# EAGLE design Thermometer1.1 (EAGLE 7.1.0)
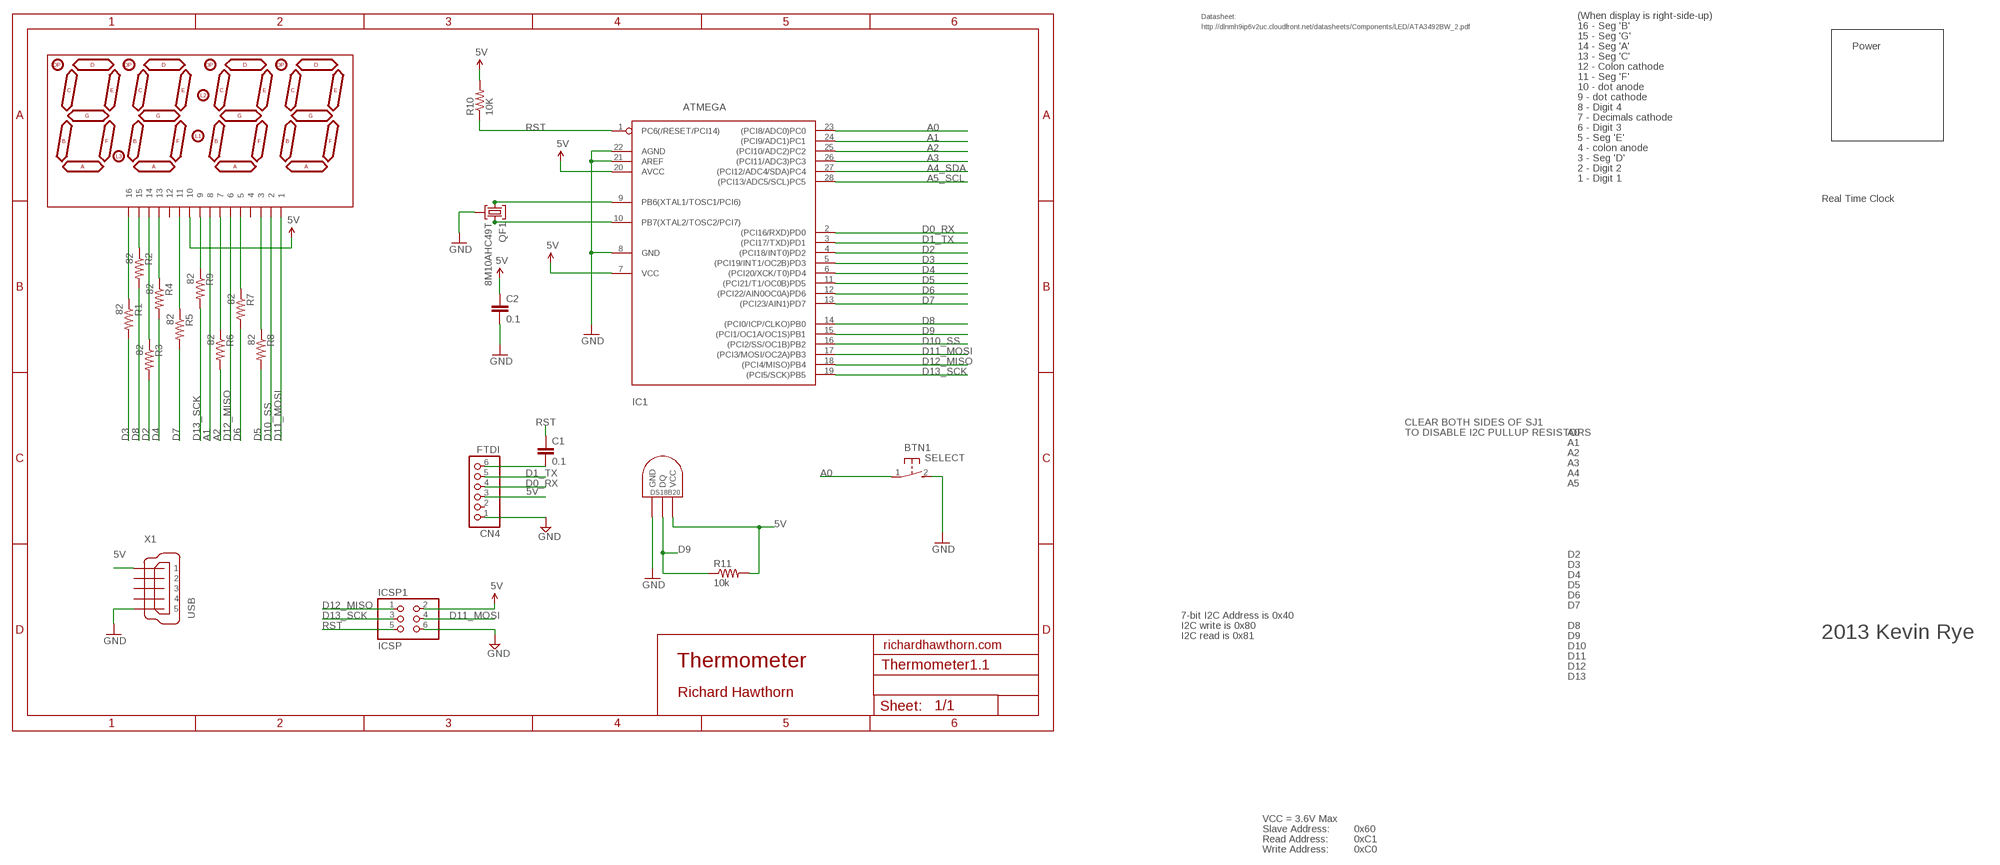
[diagram p0: schematic, sheet 1]

## Parts
BTN1  SELECT  DTS-3  [DTS-3]
C1  0.1  CAPPTH2  [CAP-PTH-SMALL2]
C2  0.1  CAPPTH2  [CAP-PTH-SMALL2]
CN4  FTDI  PINHD-1X6  [1X06]
IC1  ATMEGA  ATMEGA168PROUND  [DIL28-3-ROUND]
ICSP1  ICSP  PINHD-2X3  [2X03]
LED1  7SEG-4DIGIT  [SPARKFUN_7-SEGMENT-4DIGIT]
QF1  8M10AHC49T  [HC49U]
R1  82  R-US_0204/7  [0204/7]
R2  82  R-US_0204/7  [0204/7]
R3  82  R-US_0204/7  [0204/7]
R4  82  R-US_0204/7  [0204/7]
R5  82  R-US_0204/7  [0204/7]
R6  82  R-US_0204/7  [0204/7]
R7  82  R-US_0204/7  [0204/7]
R8  82  R-US_0204/7  [0204/7]
R9  82  R-US_0204/7  [0204/7]
R10  10K  R-US_0204/7  [0204/7]
R11  10k  R-US_0204/7  [0204/7]
U$1  DS1820TO92  [DS1820]
X1  USB  MINI-USB_SHIELD5P2-32005-601  [32005-601]

## Nets
5V: C2.1 CN4.3 IC1.7(VCC) IC1.20(AVCC) ICSP1.2 LED1.10 R10.2 R11.2 U$1.VDD(VCC) X1.1
A0: BTN1.1 IC1.23((PCI8/ADC0)PC0)
A1: IC1.24((PCI9/ADC1)PC1) R9.2
A2: IC1.25((PCI10/ADC2)PC2) R6.2
A3: IC1.26((PCI11/ADC3)PC3)
A4_SDA: IC1.27((PCI12/ADC4/SDA)PC4)
A5_SCL: IC1.28((PCI13/ADC5/SCL)PC5)
D0_RX: CN4.4 IC1.2((PCI16/RXD)PD0)
D1_TX: CN4.5 IC1.3((PCI17/TXD)PD1)
D2: IC1.4((PCI18/INT0)PD2) R3.2
D3: IC1.5((PCI19/INT1/OC2B)PD3) R1.2
D4: IC1.6((PCI20/XCK/T0)PD4) R4.2
D5: IC1.11((PCI21/T1/OC0B)PD5) R8.2
D6: IC1.12((PCI22/AIN0OC0A)PD6) R7.2
D7: IC1.13((PCI23/AIN1)PD7) R5.2
D8: IC1.14((PCI0/ICP/CLKO)PB0) R2.2
D9: IC1.15((PCI1/OC1A/OC1S)PB1) R11.1 U$1.DQ
D10_SS: IC1.16((PCI2/SS/OC1B)PB2) LED1.1
D11_MOSI: IC1.17((PCI3/MOSI/OC2A)PB3) ICSP1.4 LED1.2
D12_MISO: IC1.18((PCI4/MISO)PB4) ICSP1.1 LED1.6
D13_SCK: IC1.19((PCI5/SCK)PB5) ICSP1.3 LED1.8
GND [power]: BTN1.2 C2.2 CN4.1 IC1.8(GND) IC1.21(AREF) IC1.22(AGND) ICSP1.6 QF1.2 U$1.GND X1.5
N$3: LED1.16 R1.1
N$5: LED1.15 R2.1
N$6: LED1.9 R9.1
N$12: LED1.7 R6.1
N$16: IC1.9(PB6(XTAL1/TOSC1/PCI6)) QF1.1
N$20: C1.2 CN4.6
N$22: LED1.13 R4.1
N$24: LED1.14 R3.1
N$25: LED1.11 R5.1
N$26: IC1.10(PB7(XTAL2/TOSC2/PCI7)) QF1.3
N$29: LED1.5 R7.1
N$30: LED1.3 R8.1
RST: C1.1 IC1.1(PC6(/RESET/PCI14)) ICSP1.5 R10.1
Unconnected: CN4.2 LED1.4 LED1.12 X1.2 X1.3 X1.4 X1.M1(S1) X1.M2(S2)

## Notes on the sheet
- Datasheet: | (When display is right-side-up)
- http://dlnmh9ip6v2uc.cloudfront.net/datasheets/Components/LED/ATA3492BW_2.pdf | 16 - Seg 'B'
- 15 - Seg 'G'
- 14 - Seg 'A' | Power
- 13 - Seg 'C'
- 12 - Colon cathode
- 11 - Seg 'F'
- 10 - dot anode
- 9 - dot cathode
- 8 - Digit 4
- 7 - Decimals cathode
- 6 - Digit 3
- 5 - Seg 'E'
- 4 - colon anode
- 3 - Seg 'D'
- 2 - Digit 2
- 1 - Digit 1
- Real Time Clock
- CLEAR BOTH SIDES OF SJ1
- TO DISABLE I2C PULLUP RESISTORS | A0
- A1
- A2
- A3
- A4
- A5
- D2
- D3
- D4
- D5
- D6
- D7
- 7-bit I2C Address is 0x40
- I2C write is 0x80 | D8
- I2C read is 0x81 | D9 | 2013 Kevin Rye
- richardhawthorn.com | D10
- D11
- Thermometer | D12
- D13
- Richard Hawthorn
- VCC = 3.6V Max
- Slave Address: | 0x60
- Read Address: | 0xC1
- Write Address: | 0xC0

## Library data of the parts
BTN1 = switch-tact:DTS-3
C1 C2 = LowPowerLab:CAP: Capacitor Standard 0603 ceramic capacitor, and 0.1" leaded capacitor.
CN4 = pinhead:PINHD-1X6: PIN HEADER
IC1 = adafruit:ATMEGA168*P: MICROCONTROLLER 16 kBytes FLASH 1 kBytes SRAM 512 Bytes EEPROM USART 8-channel 10 bit ADC
ICSP1 = pinhead:PINHD-2X3: PIN HEADER
LED1 = sparkfun-4digit-sseg:7SEG-4DIGIT
QF1 = crystal:8M10AHC49T: Monolithic Crystal Filters Source: www.vanlong.com; OC_FARNELL: unknown; OC_NEWARK: unknown
R1-R11 = adafruit:R-US_: RESISTOR, American symbol
U$1 = Ava:DS1820: DS18B20 Programmable Resolution 1-Wire Digital Thermometer Description The DS18B20 digital thermometer provides 9-bit to 12-bit Celsius temperature measurements and has an alarm function with nonvolatile user-programmable upper and lower trigger points. The DS18B20 communicates over a 1-Wire® bus that by definition requires only one data line (and ground) for communication with a central microprocessor. It has an operating temperature range of -55°C to +125°C and is accurate to ±0.5°C over the range of -10°C to +85°C. In addition, the DS18B20 can derive power directly from the data line ("parasite power"), eliminating the need for an external power supply. Each DS18B20 has a unique 64-bit serial code, which allows multiple DS18B20s to function on the same 1-Wire bus. Thus, it is simple to use one microprocessor to control many DS18B20s distributed over a large area. Applications that can benefit from this feature include HVAC environmental controls, temperature monitoring systems inside buildings, equipment, or machinery, and process monitoring and control systems.
X1 = con-cypressindustries:MINI-USB_SHIELD5P2-: MINI USB-B R/A DIP 5pol. Source: www.cypressindustries.com; OC_FARNELL: unknown; OC_NEWARK: unknown

## Net classes
1 power: width 0.381 mm, clearance 0.254 mm

## Board
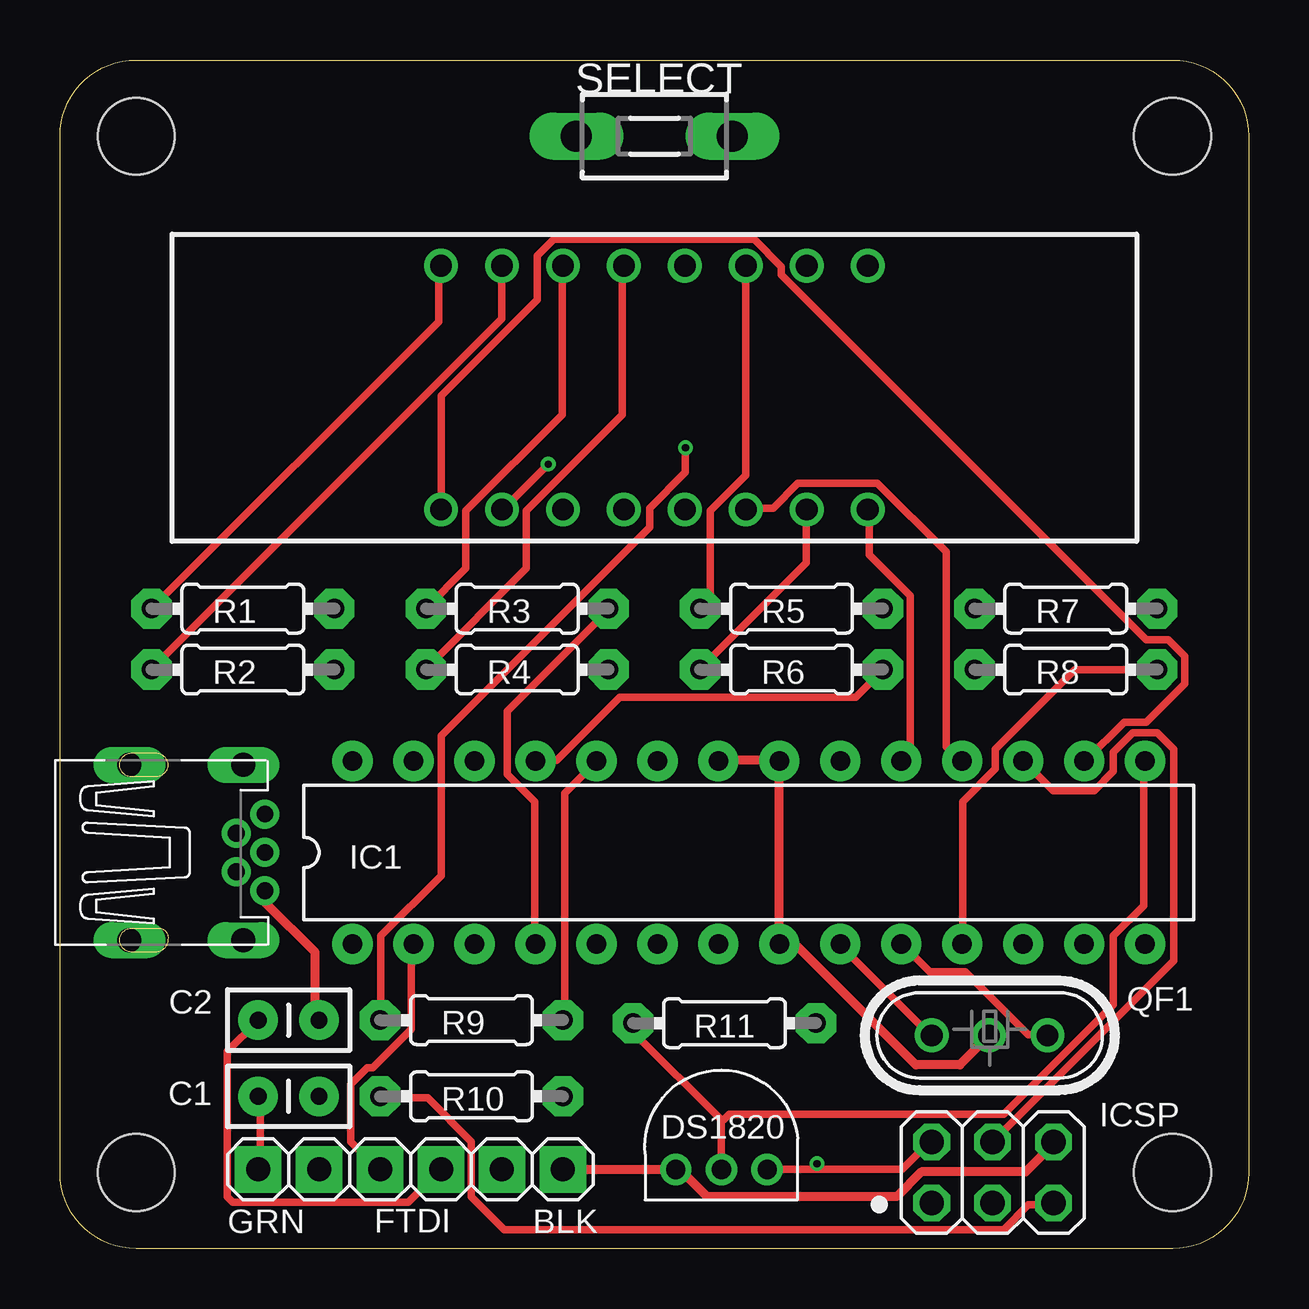
[diagram p1: board, top side]
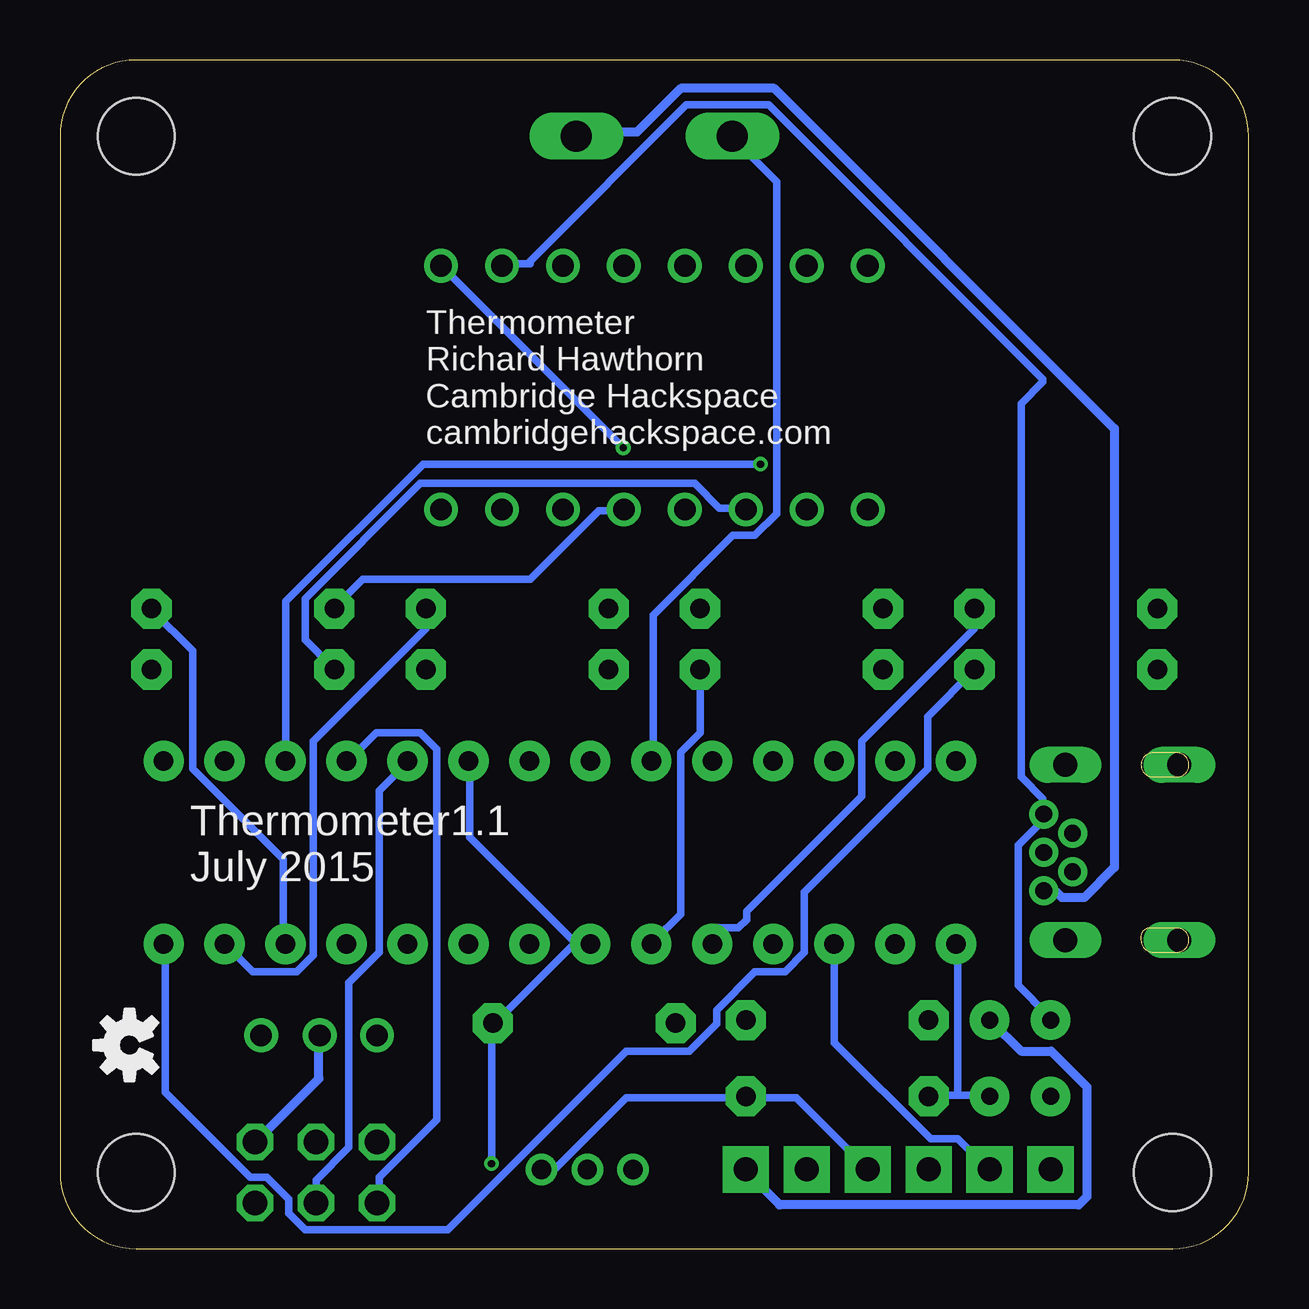
[diagram p2: board, bottom side, seen from below]

Size 49.53 x 49.53 mm. Coordinates in mm from the lower left corner, seen from the top.
Outline: 0,3.17 0,46.35 arc-90 3.17,49.53 46.35,49.53 arc-90 49.53,46.35 49.53,3.17 arc-90 46.35,0 3.17,0 arc-90 0,3.17
Copper layers (1*16): Top 0.035mm / dielectric 1.5mm / Bottom 0.035mm
Design rules "ITEADstudio_DRC *": minimum track width 12mil, minimum drill 12mil, track to track 6mil, track to pad 6mil, pad to pad 6mil, via to via 6mil, smd to smd 0mil, copper to edge 10mil, drill to drill 10mil, minimum pad ring 10mil, minimum via ring 6mil, stop-mask expansion 2mil, vias tented up to drill 100mil, thermal gap 15mil
Holes 3.2 mm at 3.17,3.17 46.35,3.17 3.17,46.35 46.35,46.35
tKeepout: area 0,0 to 5.7,5.7; area 43.8,0 to 49.5,5.7; area 43.8,43.8 to 49.5,49.5; area 0,43.8 to 5.7,49.5
bKeepout: area 0,43.8 to 5.7,49.5; area 43.8,43.8 to 49.5,49.5; area 43.8,0 to 49.5,5.7; area 0,0 to 5.7,5.7
tRestrict: area 24.3,8.9 to 29.1,12.8; area 5.8,16.9 to 6.9,18.5; area 5.2,9.7 to 6.7,10.4
bRestrict: area 27.4,17.7 to 29.2,18.7; area 21.1,13.8 to 22.9,14.9; area 21.6,12.6 to 22.1,13.2; area 20.7,12.6 to 21.2,13.2; area 20.2,12.8 to 20.7,13.5; area 20.1,13.4 to 20.6,14; area 26.5,18.9 to 27.1,19.5; area 26.5,17.9 to 27.1,18.5; area 27.5,19.1 to 28,19.8; area 27.9,18.8 to 29.1,19.6

### Footprints (pad centres in the part's own frame; a part is rotated, then mirrored left to right if it is on the bottom)
DTS-3 = drill 1.3 long: 1 -3.25,0; 2 3.25,0
CAP-PTH-SMALL2 = drill 0.7 pad 1.651: 1 0,0; 2 2.54,0
1X06 = drill 1 pad 1.93 square: 1 -6.35,0; 2 -3.81,0; 3 -1.27,0; 4 1.27,0; 5 3.81,0; 6 6.35,0
DIL28-3-ROUND = drill 0.813 pad 1.676: 1 -16.51,-3.81; 2 -13.97,-3.81; 3 -11.43,-3.81; 4 -8.89,-3.81; 5 -6.35,-3.81; 6 -3.81,-3.81; 7 -1.27,-3.81; 8 1.27,-3.81; 9 3.81,-3.81; 10 6.35,-3.81; 11 8.89,-3.81; 12 11.43,-3.81; 13 13.97,-3.81; 14 16.51,-3.81; 15 16.51,3.81; 16 13.97,3.81; 17 11.43,3.81; 18 8.89,3.81; 19 6.35,3.81; 20 3.81,3.81; 21 1.27,3.81; 22 -1.27,3.81; 23 -3.81,3.81; 24 -6.35,3.81; 25 -8.89,3.81; 26 -11.43,3.81; 27 -13.97,3.81; 28 -16.51,3.81
2X03 = drill 1.016 octagon: 1 -2.54,-1.27; 2 -2.54,1.27; 3 0,-1.27; 4 0,1.27; 5 2.54,-1.27; 6 2.54,1.27
SPARKFUN_7-SEGMENT-4DIGIT = drill 0.9: 1 -8.89,-5.08; 2 -6.35,-5.08; 3 -3.81,-5.08; 4 -1.27,-5.08; 5 1.27,-5.08; 6 3.81,-5.08; 7 6.35,-5.08; 8 8.89,-5.08; 9 8.89,5.08; 10 6.35,5.08; 11 3.81,5.08; 12 1.27,5.08; 13 -1.27,5.08; 14 -3.81,5.08; 15 -6.35,5.08; 16 -8.89,5.08
HC49U = drill 0.9: 1 -2.413,0; 2 -0.027,0; 3 2.413,0
0204/7 = drill 0.813 pad 1.676 octagon: 1 -3.81,0; 2 3.81,0
DS1820 = drill 0.8: DQ 2.54,-1.27; GND 0.635,-1.27; VDD 4.445,-1.27
32005-601 = drill 0.7 pad 1.016: 1 2.825,1.6; 2 1.625,0.8; 3 2.825,0; 4 1.625,-0.8; 5 2.825,-1.6 | drill 1 pad 1.422 long: M1 -2.825,3.65; M2 -2.825,-3.65; M3 1.925,3.65; M4 1.925,-3.65

### Placement (x,y rotation side)
BTN1  24.77,46.35 0 top
C1  10.79,6.35 180 top
C2  8.26,9.53 0 top
CN4  14.61,3.3 180 top
IC1  28.7,16.51 0 top
ICSP1  38.86,3.17 0 top
LED1  24.77,35.88 0 top
QF1  38.73,8.89 0 top
R1  7.62,26.67 0 top
R2  7.62,24.13 0 top
R3  19.05,26.67 0 top
R4  19.05,24.13 0 top
R5  30.48,26.67 0 top
R6  30.48,24.13 0 top
R7  41.91,26.67 0 top
R8  41.91,24.13 0 top
R9  17.14,9.53 0 top
R10  17.14,6.35 0 top
R11  27.69,9.4 0 top
U$1  25.02,4.57 0 top
U$3  [OSHW-LOGO-S]  46.63,8.48 90 bottom
X1  5.71,16.51 0 top

### Tracks (layer width: path | path; a pad name or v marks a point on that pad's centre or on a via)
5V  (via drill 0.3)
  Top 0.305: 31.55,3.31 35.09,3.31 36.23,4.46 ICSP1.2 | 31.55,3.31 29.49,3.31 U$1.VDD | v31.55,3.54 31.55,3.31 | CN4.3 14.52,1.94 7.2,1.94 6.97,2.17 6.97,8.23 8.23,9.49 C2.1
  Bottom 0.305: IC1.20 32.46,20.23 32.46,17.14 28.12,12.8 IC1.7 27.43,12.69 28.12,12.69 31.43,9.37 31.55,9.37 | CN4.3 18.86,6.29 20.92,6.29 R10.2 21.03,6.29 25.95,6.29 28.92,3.31 29.38,3.31 U$1.VDD | v31.55,3.54 31.55,9.37 | LED1.10 31.09,41.03 29.95,41.03 29.95,41.15 23.43,47.66 20,47.66 8.57,36.23 8.57,36.12 9.49,35.2 9.49,19.66 8.57,18.75 8.57,18.17 X1.1 8.57,18.06 8.57,17.83 9.6,16.8 9.6,10.97 8.34,9.72 C2.1 8.34,9.6 | 31.55,9.37 R11.2
A0
  Bottom 0.305: IC1.23 24.8,20.34 24.8,26.4 21.49,29.72 20.57,29.72 19.66,30.63 19.66,44.46 21.49,46.29 BTN1.1
A1
  Top 0.305: R9.2 21.03,9.6 21.03,18.97 22.29,20.23 IC1.24
A2
  Top 0.305: IC1.25 19.89,20.34 20.69,20.34 23.32,22.97 33.15,22.97 34.29,24.12 R6.2
D0_RX
  Top 0.305: IC1.2 14.63,12.69 14.63,9.14 13.03,7.54 12.8,7.54 12.12,6.86 12.12,4.46 13.26,3.31 CN4.4
D1_TX
  Bottom 0.305: IC1.3 17.26,12.69 17.26,8.57 13.26,4.57 12.12,4.57 10.86,3.31 CN4.5
D2
  Top 0.305: IC1.4 19.77,12.8 19.77,18.63 18.63,19.77 18.63,22.4 22.86,26.63 R3.2
D3
  Bottom 0.305: R1.2 11.43,25.83 16.12,21.14 16.12,18.86 20.92,14.06 20.92,13.72 21.26,13.37 22.17,13.37 22.29,13.26 22.29,12.8 IC1.5
D4
  Bottom 0.305: R4.2 22.86,21.49 23.66,20.69 23.66,13.95 24.8,12.8 IC1.6
D5
  Top 0.305: IC1.11 37.6,12.8 37.6,18.63 38.98,20 38.98,20.8 42.29,24.12 45.72,24.12 R8.2
D6
  Bottom 0.305: IC1.12 40.23,12.8 40.23,16.23 44.01,20 44.01,24.92 45.72,26.63 R7.2
D7
  Bottom 0.305: R5.2 34.29,25.83 38.98,21.14 38.98,12.23 39.66,11.54 41.49,11.54 42.63,12.69 IC1.13
D8
  Bottom 0.305: IC1.14 45.15,12.69 45.15,6.51 41.6,2.97 40.92,2.97 40.01,2.06 40.01,1.49 39.32,0.8 33.38,0.8 25.95,8.23 23.32,8.23 22.17,9.37 22.17,9.94 20.57,11.54 19.32,11.54 18.52,12.34 18.52,14.86 13.37,20 13.37,22.17 11.43,24.12 R2.2
D9
  Top 0.305: 27.55,5.37 27.55,3.31 U$1.DQ | 27.55,5.37 23.89,9.03 23.89,9.37 R11.1 | IC1.15 45.15,20.23 45.15,14.29 43.89,13.03 43.89,10.17 39.32,5.6 27.89,5.6 27.66,5.37 27.55,5.37
D10_SS
  Top 0.305: LED1.1 15.89,30.86 15.89,35.55 19.89,39.55 19.89,41.38 20.57,42.06 28.92,42.06 30.06,40.92 30.06,40.58 45.26,25.38 46.18,25.38 46.86,24.69 46.86,23.55 45.26,21.95 44.35,21.95 42.75,20.34 IC1.16
D11_MOSI  (via drill 0.3)
  Top 0.305: v20.34,32.69 18.52,30.86 LED1.2 | ICSP1.4 46.41,12 46.41,20.8 45.72,21.49 44.69,21.49 43.89,20.69 43.89,19.89 43.09,19.09 41.38,19.09 40.23,20.23 IC1.17
  Bottom 0.305: v20.34,32.69 34.4,32.69 40.12,26.98 40.12,20.34 IC1.17
D12_MISO
  Top 0.305: LED1.6 28.57,30.86 29.72,30.86 30.75,31.89 34.06,31.89 36.92,29.03 36.92,20.92 37.49,20.34 IC1.18
  Bottom 0.305: ICSP1.1 36.23,1.94 36.23,2.97 33.83,5.37 33.83,20.8 34.52,21.49 36.35,21.49 37.49,20.34 IC1.18
D13_SCK
  Top 0.305: LED1.8 33.72,30.75 33.72,28.92 35.43,27.2 35.43,20.69 35.09,20.34 IC1.19
  Bottom 0.305: ICSP1.3 38.86,2.86 37.49,4.23 37.49,11.09 36.23,12.34 36.23,19.09 35.09,20.23 IC1.19
GND
  Top 0.381: IC1.22 27.43,20.34 29.83,20.34 IC1.21 29.95,20.23 29.95,12.8 IC1.8 30.06,12.57 30.75,12.57 35.66,7.66 37.49,7.66 38.63,8.8 QF1.2 | CN4.1 21.03,3.31 25.6,3.31 U$1.GND 25.83,3.31 26.98,2.17 34.86,2.17 35.89,3.2 40.23,3.2 41.38,4.34 ICSP1.6 | 10.74,9.6 C2.2 10.63,9.72 10.63,12.34 8.57,14.4 8.57,14.86 X1.5
  Bottom 0.381: QF1.2 38.75,8.8 38.75,7.09 41.38,4.46 ICSP1.6 | 28,46.41 BTN1.2 27.89,46.52 25.49,46.52 23.66,48.35 19.77,48.35 5.6,34.18 5.6,15.89 6.86,14.63 7.77,14.63 8,14.86 8.46,14.86 X1.5 | CN4.1 20.92,3.2 19.55,1.83 7.09,1.83 6.74,2.17 6.74,6.74 8.23,8.23 9.49,8.23 10.74,9.49 C2.2
N$3
  Top 0.305: R1.1 15.77,38.63 15.77,40.92 LED1.16
N$5
  Top 0.305: LED1.15 18.4,40.92 18.4,38.75 3.89,24.23 R2.1
N$6  (via drill 0.3)
  Top 0.305: v26.06,33.38 26.06,32.35 24.57,30.86 24.57,30.06 15.89,21.37 15.89,15.54 13.37,13.03 13.37,9.6 R9.1
  Bottom 0.305: v26.06,33.38 33.6,40.92 LED1.9
N$12
  Top 0.305: LED1.7 31.09,30.75 31.09,28.57 26.75,24.23 R6.1
N$16
  Top 0.305: QF1.1 36.23,8.91 32.46,12.69 IC1.9
N$20
  Top 0.305: C1.2 8.34,6.29 8.34,3.31 CN4.6
N$22
  Top 0.305: LED1.13 23.43,40.92 23.43,34.75 19.43,30.75 19.43,28.35 15.32,24.23 R4.1
N$24
  Top 0.305: R3.1 16.92,28.35 16.92,30.75 20.92,34.75 20.92,40.92 LED1.14
N$25
  Top 0.305: LED1.11 28.57,32.23 27.09,30.75 27.09,27.09 R5.1
N$26
  Top 0.305: QF1.3 41.15,8.91 40.35,8.91 37.72,11.54 36.23,11.54 35.09,12.69 IC1.10
N$29
  Bottom 0.305: LED1.5 26.06,30.75 27.09,30.75 29.95,27.89 36.92,27.89 38.06,26.75 R7.1
N$30
  Bottom 0.305: LED1.3 21.03,30.86 22.06,30.86 23.09,31.89 34.52,31.89 39.32,27.09 39.32,25.38 38.18,24.23 R8.1
RST
  Top 0.305: ICSP1.5 41.38,1.83 40.35,1.83 39.32,0.8 18.52,0.8 17.14,2.17 17.14,4.46 15.32,6.29 13.37,6.29 R10.1
  Bottom 0.305: 12.12,6.4 13.26,6.4 R10.1 | 12.12,6.4 10.86,6.4 C1.1 | 12.12,6.4 12.12,12.69 IC1.1

### Text on the board
tNames: GRN | FTDI | BLK
bNames: Thermometer / Richard Hawthorn / Cambridge Hackspace / cambridgehackspace.com | Thermometer1.1 / July 2015
tDocu: REG